# EAGLE design LoRa_v2 (EAGLE 9.6.2)
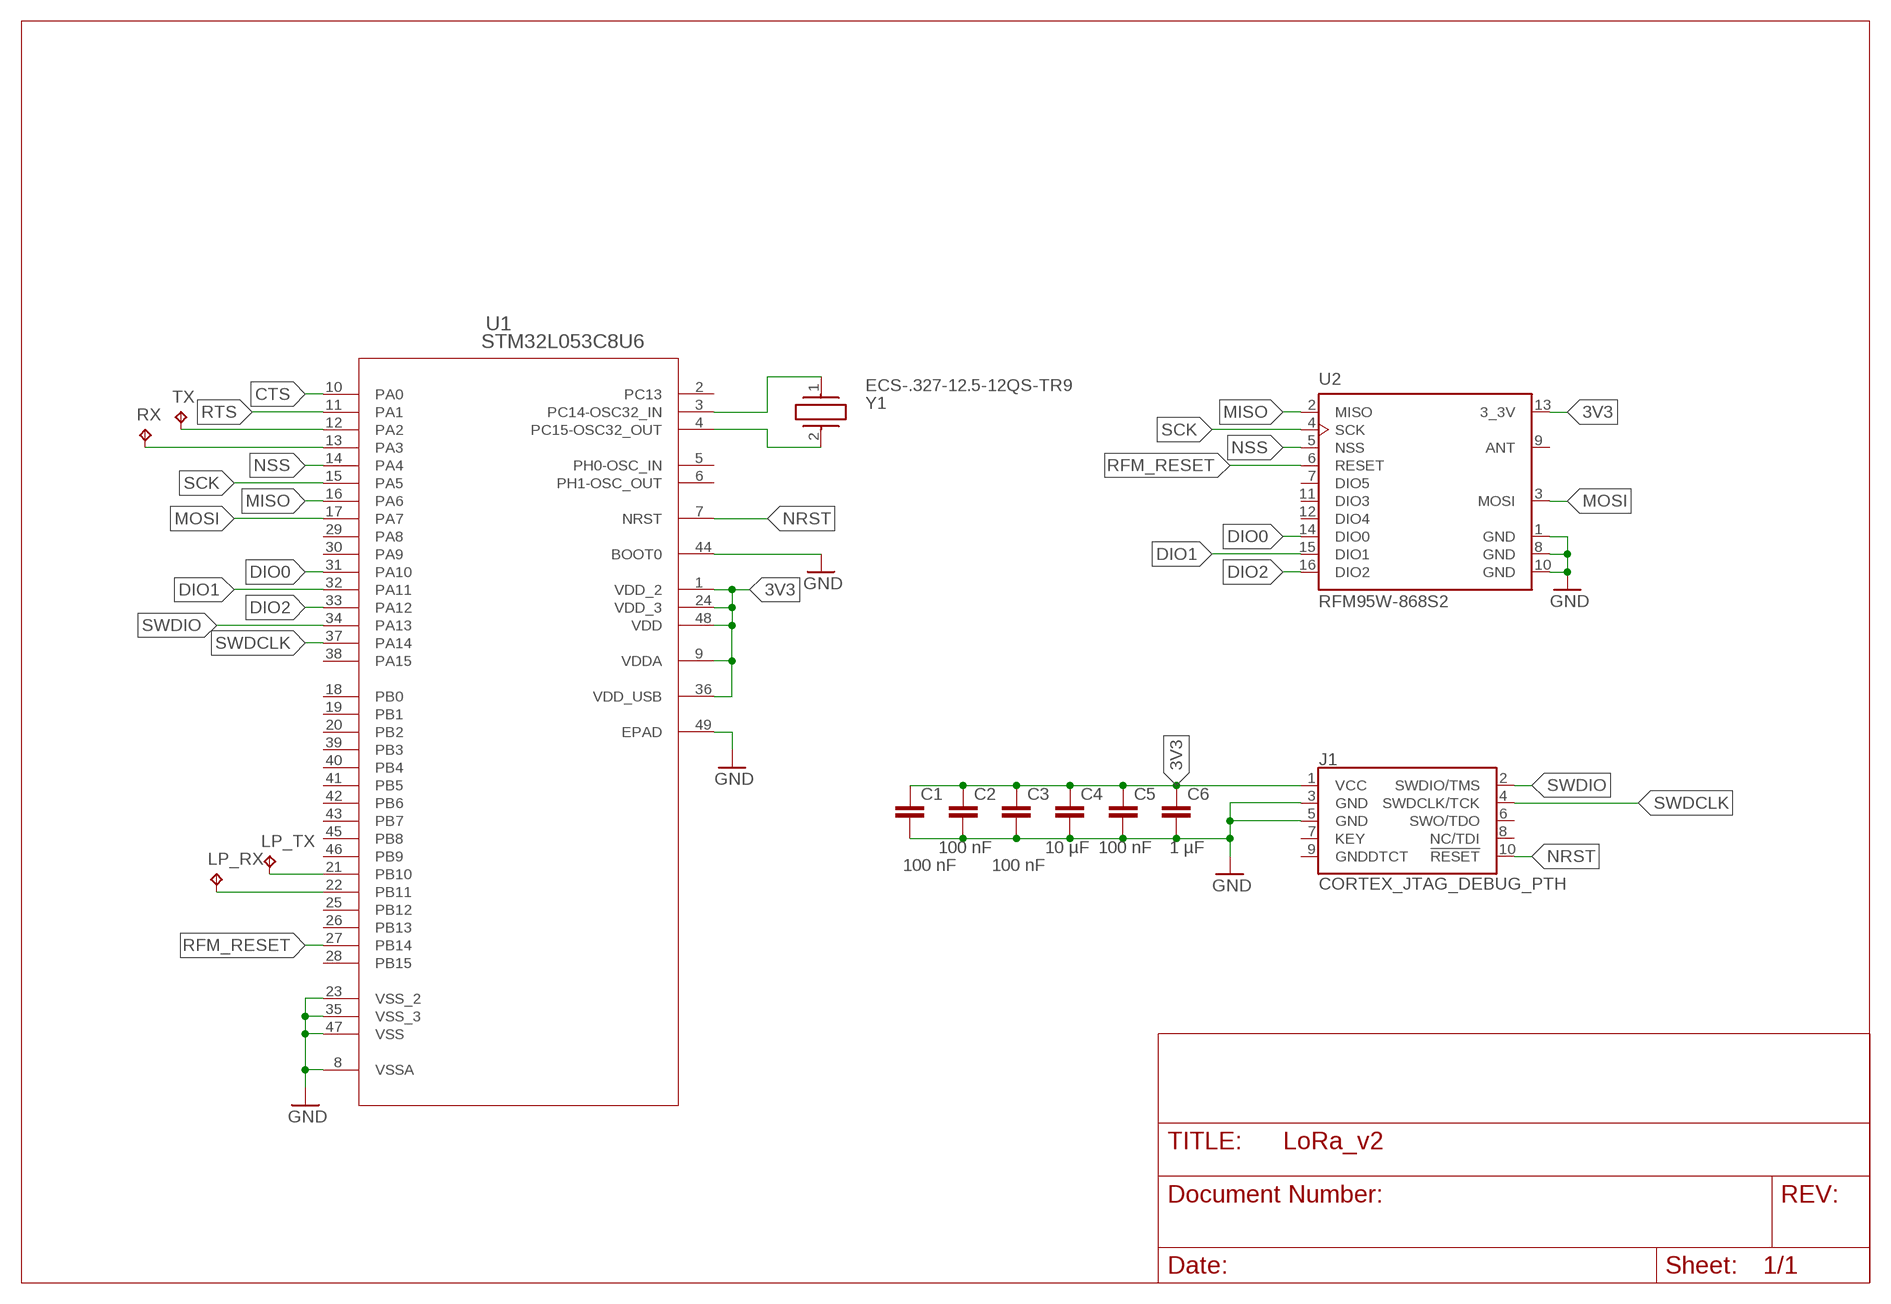
[diagram p0: schematic, sheet 1]

## Parts
C1  100 nF  C-EUC0402  [C0402]
C2  100 nF  C-EUC0402  [C0402]
C3  100 nF  C-EUC0402  [C0402]
C4  10 µF  C-EUC0402  [C0402]
C5  100 nF  C-EUC0402  [C0402]
C6  1 µF  C-EUC0402  [C0402]
J1  CORTEX_JTAG_DEBUG_PTH  [2X5-PTH-1.27MM]
LP_RX  TPB1,27  [B1,27]
LP_TX  TPB1,27  [B1,27]
RX  TPB1,27  [B1,27]
TX  TPB1,27  [B1,27]
U1  STM32L053C8U6  [UFQFPN-48_STM]
U2  RFM95W-868S2  [XCVR_RFM95W-868S2]
Y1  ECS-.327-12.5-12QS-TR9  [ECS32712512QSTR9]

## Nets
3V3: C1.1 C2.1 C3.1 C4.1 C5.1 C6.1 J1.1(VCC) U1.1(VDD_2) U1.9(VDDA) U1.24(VDD_3) U1.36(VDD_USB) U1.48(VDD) U2.13(3_3V)
CTS: U1.10(PA0)
DIO0: U1.31(PA10) U2.14(DIO0)
DIO1: U1.32(PA11) U2.15(DIO1)
DIO2: U1.33(PA12) U2.16(DIO2)
GND: C1.2 C2.2 C3.2 C4.2 C5.2 C6.2 J1.3(GND) J1.5(GND) U1.8(VSSA) U1.23(VSS_2) U1.35(VSS_3) U1.44(BOOT0) U1.47(VSS) U1.49(EPAD) U2.1(GND) U2.8(GND) U2.10(GND)
MISO: U1.16(PA6) U2.2(MISO)
MOSI: U1.17(PA7) U2.3(MOSI)
N$1: U1.3(PC14-OSC32_IN) Y1.1
N$2: LP_RX.TP U1.22(PB11)
N$3: U1.4(PC15-OSC32_OUT) Y1.2
N$4: LP_TX.TP U1.21(PB10)
NRST: J1.10(!RESET) U1.7(NRST)
NSS: U1.14(PA4) U2.5(NSS)
RFM_RESET: U1.27(PB14) U2.6(RESET)
RTS: U1.11(PA1)
RX: RX.TP U1.13(PA3)
SCK: U1.15(PA5) U2.4(SCK)
SWDCLK: J1.4(SWDCLK/TCK) U1.37(PA14)
SWDIO: J1.2(SWDIO/TMS) U1.34(PA13)
TX: TX.TP U1.12(PA2)
Unconnected: J1.6(SWO/TDO) J1.7(KEY) J1.8(NC/TDI) J1.9(GNDDTCT) U1.2(PC13) U1.5(PH0-OSC_IN) U1.6(PH1-OSC_OUT) U1.18(PB0) U1.19(PB1) U1.20(PB2) U1.25(PB12) U1.26(PB13) U1.28(PB15) U1.29(PA8) U1.30(PA9) U1.38(PA15) U1.39(PB3) U1.40(PB4) U1.41(PB5) U1.42(PB6) U1.43(PB7) U1.45(PB8) U1.46(PB9) U2.7(DIO5) U2.9(ANT) U2.11(DIO3) U2.12(DIO4)

## Library data of the parts
C1-C6 = rcl:C-EU: CAPACITOR, European symbol; SPICEPREFIX: C
J1 = SparkFun-Connectors:CORTEX_JTAG_DEBUG: Cortex Debug Connector - 10 pin Supports JTAG debug, Serial Wire debug, and Serial Wire Viewer. PTH and SMD connector options available. General Connector Information <http://infocenter.arm.com/help/topic/com.arm.doc.faqs/attached/13634/cortex_debug_connectors.pdf> Products: PTH Connector <http://www.digikey.com/product-detail/en/cnc-tech/3220-10-0100-00/1175-1627-ND/3883661> -via Digi-Key SparkFun PSoc <https://www.sparkfun.com/products/13229> SparkFun T <https://www.sparkfun.com/products/13810>
LP_RX LP_TX RX TX = testpad:TP: Test pad
U1 = STM32L053C8_func:STM32L053C8U6; COPYRIGHT: Copyright (C) 2023 Ultra Librarian. All rights reserved.; MANUFACTURER_PART_NUMBER: STM32L053C8U6; MFR_NAME: STMicroelectronics
U2 = RFM95W-868S2:RFM95W-868S2: Mod Txrx Lora +20dbm 868mhz Smd Check availability <https://pricing.snapeda.com/parts/RFM95W-868S2/RF/view-part?ref=eda>; AVAILABILITY: In Stock; DESCRIPTION: General ISM < 1GHz LoRa™ Transceiver Module 868MHz Antenna Not Included Surface Mount; MF: RF; MP: RFM95W-868S2; PACKAGE: SMD-16 Hope Microelectronics; PRICE: None; PURCHASE-URL: https://pricing.snapeda.com/search/part/RFM95W-868S2/?ref=eda
Y1 = ECS-.327-12.5-12QS-TR9:ECS-.327-12.5-12QS-TR9: Crystals 32.786kHz 12.5pF 20ppm -40C +125C Source: Datasheet <https://ecsxtal.com/store/pdf/ECX-12Q.pdf>; DESCRIPTION: Crystals 32.786kHz 12.5pF 20ppm -40C +125C; HEIGHT: 0.6mm; MANUFACTURER_NAME: ECS; MANUFACTURER_PART_NUMBER: ECS-.327-12.5-12QS-TR9

## Board
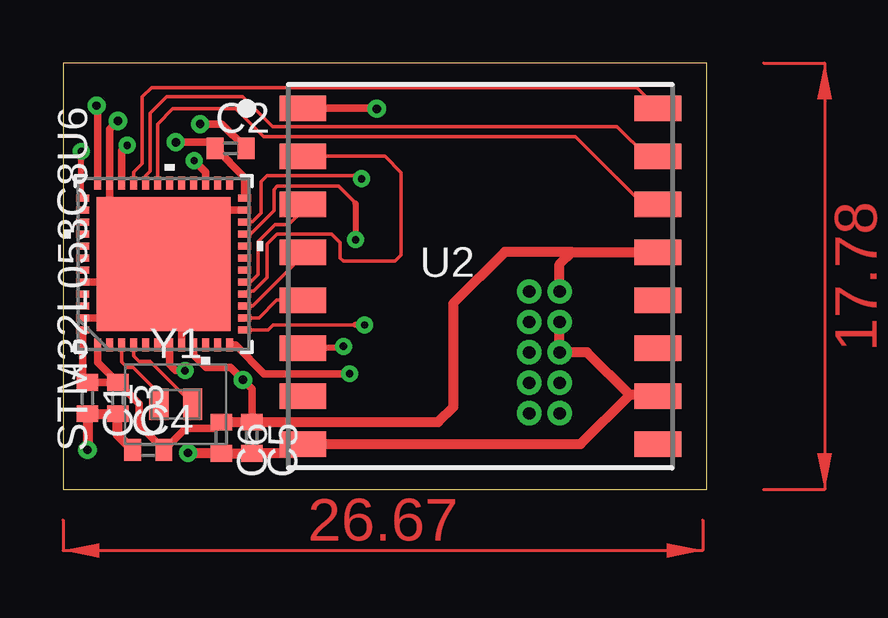
[diagram p1: board, top side]
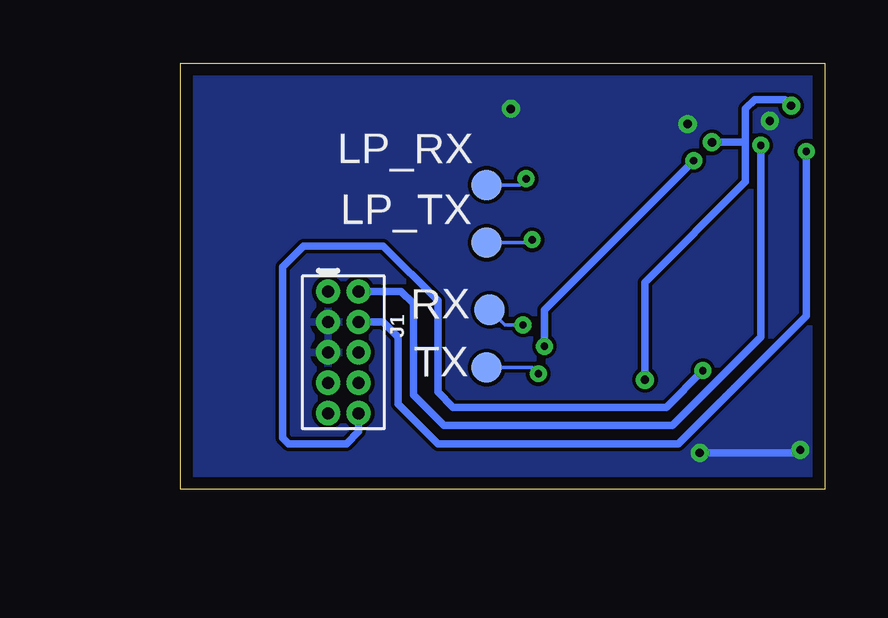
[diagram p2: board, bottom side, seen from below]

Size 26.85 x 17.77 mm. Coordinates in mm from the lower left corner, seen from the top.
Outline: 0,0 26.85,0 26.85,17.77 0,17.77 0,0
Copper layers (1*16): Top 0.035mm / dielectric 1.5mm / Bottom 0.035mm
Design rules "default *": minimum track width 6mil, minimum drill 0.35mm, track to track 6mil, track to pad 6mil, pad to pad 6mil, via to via 6mil, smd to smd 6mil, copper to edge 20mil, drill to drill 6mil, minimum pad ring 10mil, minimum via ring 8mil, stop-mask expansion 4mil, vias tented up to drill 0mil, thermal gap 10mil

### Footprints (pad centres in the part's own frame; a part is rotated, then mirrored left to right if it is on the bottom)
C0402 = smd 0.7 x 0.9: 1 -0.65,0; 2 0.65,0
2X5-PTH-1.27MM = drill 0.508 pad 1: 1 -2.54,-0.635; 2 -2.54,0.635; 3 -1.27,-0.635; 4 -1.27,0.635; 5 0,-0.635; 6 0,0.635; 7 1.27,-0.635; 8 1.27,0.635; 9 2.54,-0.635; 10 2.54,0.635
B1,27 = smd 1.27 x 1.27: TP 0,0
UFQFPN-48_STM = smd 0.55 x 0.3: 1 -3.375,2.751; 2 -3.375,2.251; 3 -3.375,1.75; 4 -3.375,1.25; 5 -3.375,0.75; 6 -3.375,0.25; 7 -3.375,-0.25; 8 -3.375,-0.75; 9 -3.375,-1.25; 10 -3.375,-1.75; 11 -3.375,-2.251; 12 -3.375,-2.751; 25 3.375,-2.751; 26 3.375,-2.251; 27 3.375,-1.75; 28 3.375,-1.25; 29 3.375,-0.75; 30 3.375,-0.25; 31 3.375,0.25; 32 3.375,0.75; 33 3.375,1.25; 34 3.375,1.75; 35 3.375,2.251; 36 3.375,2.751 | smd 0.3 x 0.55: 13 -2.75,-3.375; 14 -2.25,-3.375; 15 -1.75,-3.375; 16 -1.25,-3.375; 17 -0.75,-3.375; 18 -0.25,-3.375; 19 0.25,-3.375; 20 0.75,-3.375; 21 1.25,-3.375; 22 1.75,-3.375; 23 2.25,-3.375; 24 2.75,-3.375; 37 2.75,3.375; 38 2.25,3.375; 39 1.75,3.375; 40 1.25,3.375; 41 0.75,3.375; 42 0.25,3.375; 43 -0.25,3.375; 44 -0.75,3.375; 45 -1.25,3.375; 46 -1.75,3.375; 47 -2.25,3.375; 48 -2.75,3.375 | smd 5.6 x 5.6: 49 0,0
XCVR_RFM95W-868S2 = smd 1.95 x 1.05: 1 -7.4,7; 2 -7.4,5; 3 -7.4,3; 4 -7.4,1; 5 -7.4,-1; 6 -7.4,-3; 7 -7.4,-5; 8 -7.4,-7; 9 7.4,-7; 10 7.4,-5; 11 7.4,-3; 12 7.4,-1; 13 7.4,1; 14 7.4,3; 15 7.4,5; 16 7.4,7
ECS32712512QSTR9 = smd 0.8 x 1.3: 1 -0.7,0; 2 0.7,0

### Placement (x,y rotation side)
C1  1.02,3.81 270 top
C2  6.99,14.22 0 top
C3  2.29,3.81 270 top
C4  3.56,1.65 180 top
C5  7.87,2.16 270 top
C6  6.6,2.16 270 top
J1  20.07,5.71 270 bottom
LP_RX  14.1,12.7 0 bottom
LP_TX  14.1,10.29 0 bottom
RX  13.97,7.49 0 bottom
TX  14.1,5.08 0 bottom
U1  4.19,9.4 90 top
U2  17.4,8.89 0 top
Y1  4.7,3.56 0 top

### Tracks (layer width: path | path; a pad name or v marks a point on that pad's centre or on a via)
3V3  (via drill 0.35)
  Top 0.305: U1.1 1.44,5.31 C3.1 | U1.24 7.57,13.01 6.35,14.22 C2.1 6.08,14.48 v4.7,14.48 | U1.9 5.44,5.61 5.97,5.08 6.99,5.08 v7.49,4.57 7.87,4.19 C5.1 | C6.1 6.35,2.56 5.11,2.56 C4.1 3.17,2.68 3.17,3.57 C3.1 | U1.48 0.82,4.66 C1.1 C3.1 | U1.36 1.44,15.96 v1.4,16
  Top 0.406: J1.1 20.7,9.4 21.21,9.91 | 21.21,9.91 24.78,9.91 U2.13 | 21.21,9.91 18.41,9.91 16.26,7.75 16.26,3.43 15.64,2.81 C5.1 C6.1
  Bottom 0.305: v7.49,4.57 7.49,8.64 3.3,12.83 3.3,14.48 | v4.7,14.48 3.3,14.48 | 3.3,14.48 3.3,15.88 2.92,16.26 1.65,16.26 v1.4,16
DIO0
  Top 0.152: U2.14 24.72,11.81 24.26,11.81 21.36,14.71 8.36,14.71 7.19,15.88 4.57,15.88 3.94,15.24 U1.31
DIO1
  Top 0.152: U2.15 24.34,13.89 23.09,15.14 8.74,15.14 7.49,16.38 4.32,16.38 3.63,15.7 3.63,13.28 3.44,13.09 U1.32
DIO2
  Top 0.152: U2.16 23.93,16.76 3.68,16.76 3.3,16.38 3.3,13.59 2.94,13.23 U1.33
GND  (via drill 0.35)
  Top 0.305: 7.62,14.24 C2.2 6.62,15.24 v5.71,15.24 | U2.1 13.07,15.89 v13.08,15.88 | U1.8 4.94,8.65 U1.49 | U1.47 1.94,7.15 3.37,8.57 3.29,8.65 | U1.49 3.17,9.4 1.94,10.63 U1.35 1.94,15.02 v2.29,15.37 | U1.23 5.42,11.65 4.19,10.41 U1.49 | U1.44 3.29,8.65 | 3.29,8.65 3.44,8.65 U1.49 | U1.49 3.49,8.7
  Top 0.406: v5.21,1.52 6.59,1.52 C6.2 C5.2 9.62,1.51 U2.8 21.57,1.89 23.62,3.94 | v1.02,1.65 C1.2 C3.2 2.29,2.27 C4.2 | 23.62,3.94 24.75,3.94 U2.10 | 23.62,3.94 21.84,5.71 J1.5 J1.3
  Bottom 0.305: v1.02,1.65 1.14,1.52 v5.21,1.52
  pour Bottom: 0,17.78 0,0 26.67,0 26.67,17.78
MISO
  Top 0.152: U1.16 7.69,8.27 7.94,8.27 8.51,8.84 8.51,10.22 8.93,10.64 11.2,10.64 11.56,10.29 11.56,9.65 11.68,9.53 13.84,9.53 14.1,9.78 14.1,13.21 13.41,13.89 U2.2 10.08,13.97
MOSI
  Top 0.152: U1.17 7.81,8.65 8.13,8.96 8.13,10.34 8.84,11.05 9.4,11.05 10,11.65 U2.3
N$1
  Top 0.152: Y1.1 4,4 2.92,5.08 2.67,5.08 2.44,5.31 U1.3
N$2  (via drill 0.3)
  Top 0.152: U1.22 7.59,11.18 7.91,11.18 8.26,11.52 8.26,12.83 8.51,13.08 12.19,13.08
  Top 0.254: 12.19,13.08 12.32,13.08 v12.45,12.95
  Bottom 0.152: v12.45,12.95 12.7,12.7 LP_RX.TP
N$3
  Top 0.152: U1.4 2.94,5.57 3.17,5.33 3.62,5.33 Y1.2
N$4  (via drill 0.3)
  Top 0.152: U1.21 7.81,10.64 8.79,11.63 8.79,12.51 8.93,12.64 11.49,12.64 12.19,11.94
  Top 0.254: 12.19,11.94 v12.19,10.41
  Bottom 0.152: v12.19,10.41 12.32,10.29 LP_TX.TP
NRST  (via drill 0.3)
  Top 0.305: U1.7 4.44,5.21 4.7,4.95 v5.08,4.95
  Bottom 0.305: v5.08,4.95 6.6,3.43 15.49,3.43 16.13,4.06 16.13,7.87 18.41,10.16 21.72,10.16 22.61,9.27 22.61,2.16 22.35,1.91 19.94,1.91 19.43,2.41 J1.10
NSS
  Top 0.152: U2.5 8.91,7.89 8.16,7.15 U1.14
RFM_RESET  (via drill 0.3)
  Top 0.152: 10.92,5.89 U2.6
  Top 0.254: v11.68,5.97 11.61,5.89 10.92,5.89
  Top 0.305: U1.27 5.94,13.24 v5.46,13.72
  Bottom 0.305: v11.68,5.97 11.68,7.49 v5.46,13.72
RX  (via drill 0.3)
  Top 0.152: U1.13 8.55,6.65 8.76,6.86 12.19,6.86
  Top 0.254: v12.57,6.86 12.19,6.86
  Bottom 0.152: v12.57,6.86 13.34,6.86 RX.TP
SCK
  Top 0.152: U2.4 10,9.87 9.96,9.91 9.65,9.91 9.65,9.4 7.9,7.65 U1.15
SWDCLK  (via drill 0.3)
  Top 0.254: U1.37 0.76,12.2 v0.76,14.1
  Bottom 0.305: v0.76,14.1 0.76,7.24 6.1,1.91 16.13,1.91 17.78,3.56 17.78,6.35 18.41,6.99 J1.4
SWDIO  (via drill 0.3)
  Top 0.305: U1.34 2.44,14.12 v2.67,14.35
  Bottom 0.305: v2.67,14.35 2.67,6.35 6.35,2.67 15.88,2.67 17.14,3.94 17.14,7.75 17.65,8.26 J1.2
TX  (via drill 0.3)
  Top 0.305: U1.12 7.18,6.02 8.38,4.83 v11.94,4.83
  Bottom 0.152: v11.94,4.83 12.19,5.08 TX.TP
(copper drawn outside any net)
  shapes: Top area x2